# Altium project Face_PWR1V0.PrjPcb
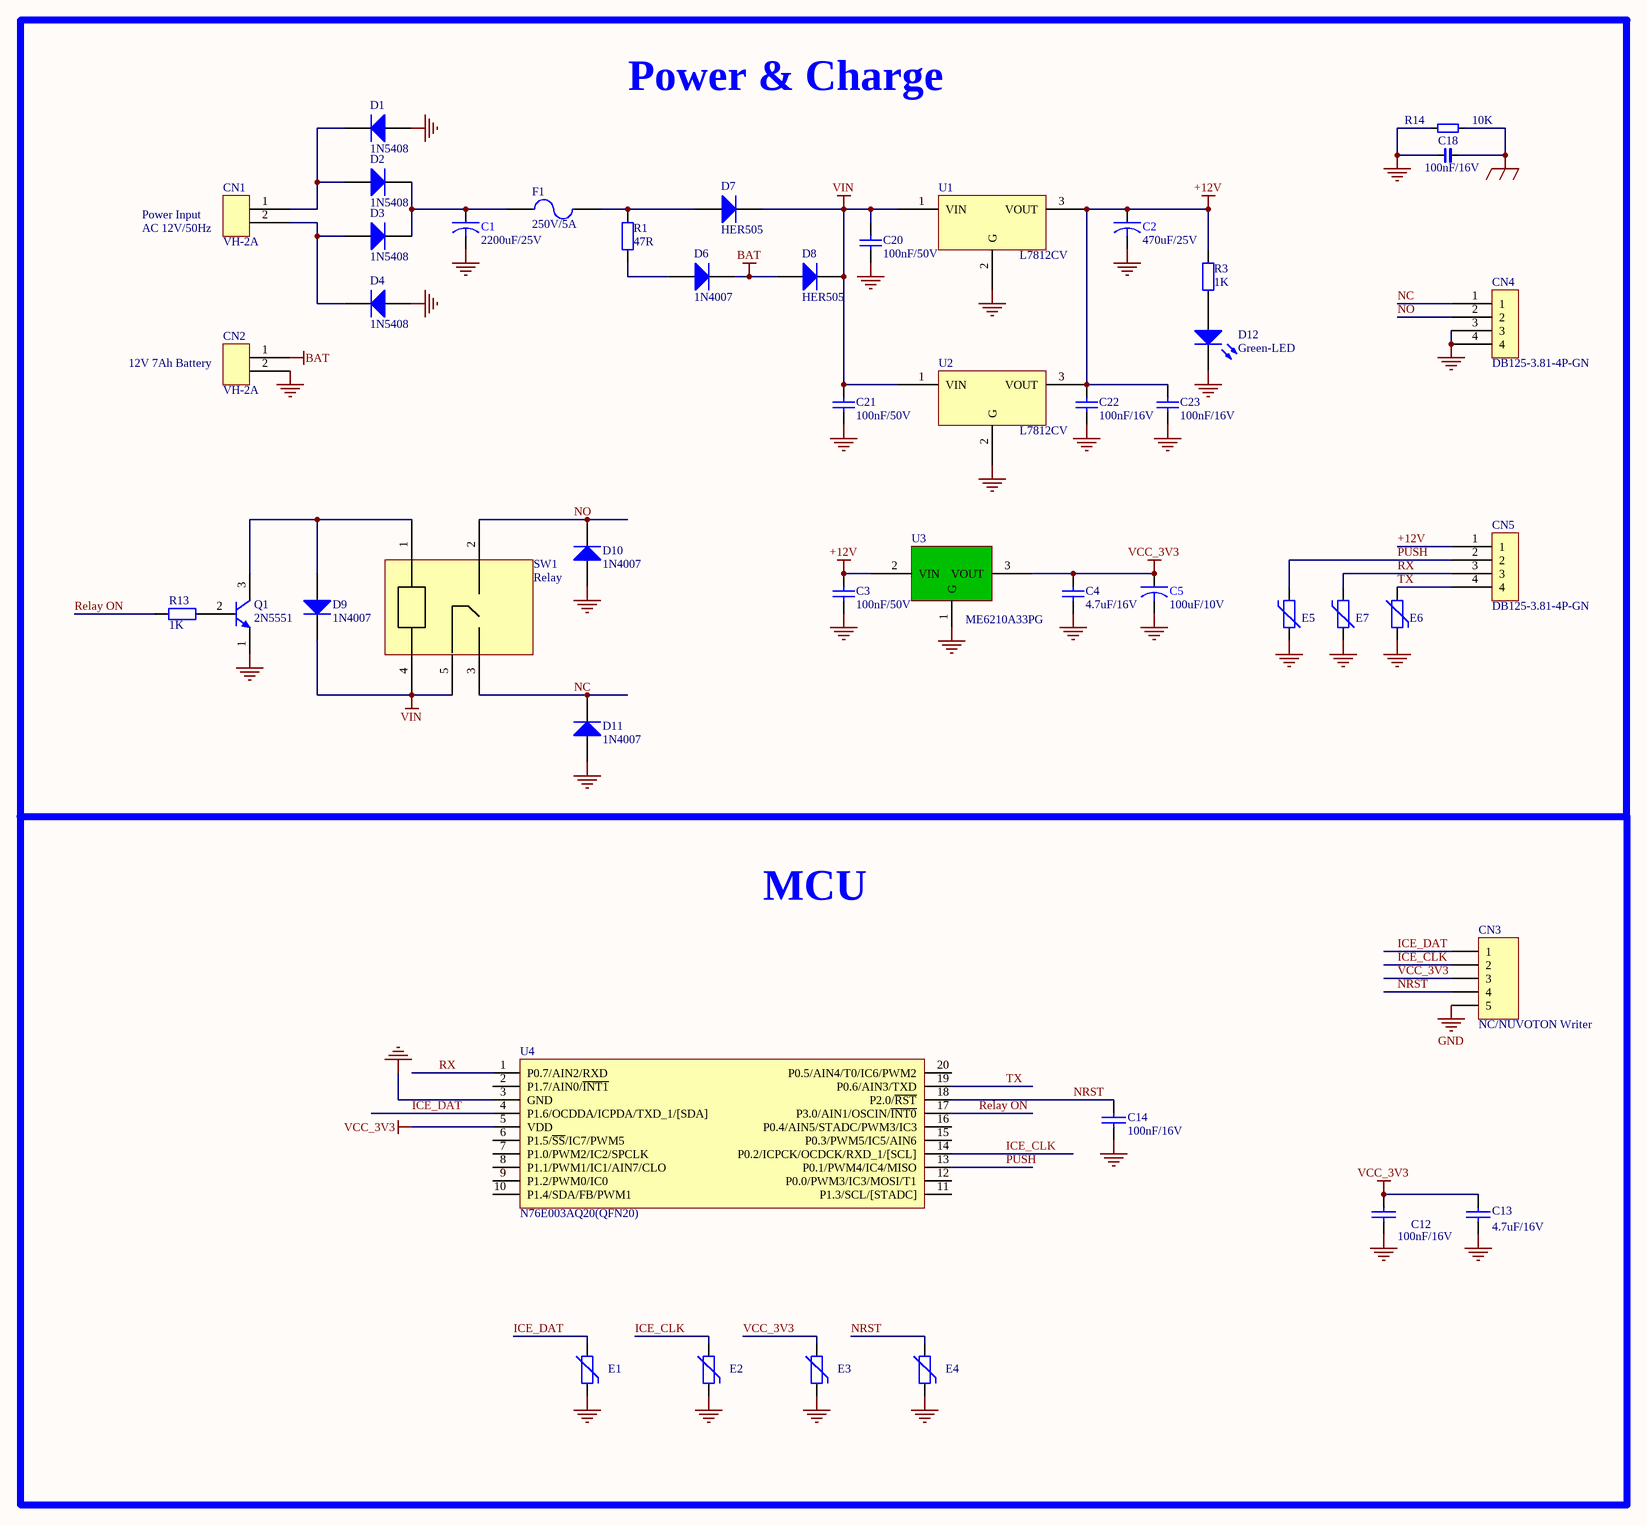
[diagram p0: Face_PWR1V0.SchDoc]
1 sheet, 47 parts. Net scope: global (net labels, ports and power ports of the same name join across sheets).
Board file: Face_PWR1V0.PcbDoc

## Sheet Face_PWR1V0.SchDoc
size C

### Parts
C1  2200uF/25V  [CAP 13x21mm]
C2  470uF/25V  [CAP-TH_BD8.0-P3.50-D1.0-FD]
C3  100nF/50V  [C0603]
C4  4.7uF/16V  [C0603]
C5  100uF/10V  [C_ALU_5.3MM]
C12  100nF/16V  [C0402]
C13  4.7uF/16V  [C0603]
C14  100nF/16V  [C0402]
C18  100nF/16V  [C0402]
C20  100nF/50V  [C0603]
C21  100nF/50V  [C0603]
C22  100nF/16V  [C0402]
C23  100nF/16V  [C0402]
CN1  VH-2A  [VH3.96-2A]
CN2  VH-2A  [VH3.96-2A]
CN3  NC/NUVOTON Writer  [HD5_2.0]
CN4  DB125-3.81-4P-GN  [DB125-3.81-4P-GN]
CN5  DB125-3.81-4P-GN  [DB125-3.81-4P-GN]
D1  1N5408  [DO-201AD]
D2  1N5408  [DO-201AD]
D3  1N5408  [DO-201AD]
D4  1N5408  [DO-201AD]
D6  1N4007  [DO-41]
D7  HER505  [DO-201AD]
D8  HER505  [DO-201AD]
D9  1N4007  [DO-41]
D10  1N4007  [DO-41]
D11  1N4007  [DO-41]
D12  Green-LED  [LED-TH_BD3.0-P2.54-FD]
E1  SFI0402-050E330NP-LF  [R0402]  (value not drawn)
E2  SFI0402-050E330NP-LF  [R0402]  (value not drawn)
E3  SFI0402-050E330NP-LF  [R0402]  (value not drawn)
E4  SFI0402-050E330NP-LF  [R0402]  (value not drawn)
E5  SFI0402-050E330NP-LF  [R0402]  (value not drawn)
E6  SFI0402-050E330NP-LF  [R0402]  (value not drawn)
E7  SFI0402-050E330NP-LF  [R0402]  (value not drawn)
F1  250V/5A  [5x20 Fuse socket]
Q1  2N5551  [TO-92-3_L4.8-W3.7-P2.54L]
R1  47R  [AXIAL-1.3]
R3  1K  [R0603]
R13  1K  [R0402]
R14  10K  [R0402]
SW1  Relay  [RELAY-TH_SRD-XXVDC-XL-C]
U1  L7812CV  [TO-220-3]
U2  L7812CV  [TO-220-3]
U3  ME6210A33PG  [SOT-89]
U4  N76E003AQ20(QFN20)  [QFN20_3*3mm]

### Blocks framed on the sheet
Power & Charge: C1-C5 C18 C20-C23 CN1 CN2 CN4 CN5 D1-D4 D6-D12 E5-E7 F1 Q1 R1 R3 R13 R14 SW1 U1-U3

### Nets
+12V: C2.1 C3.2 C22.2 C23.2 CN5.1 R3.2 U1.3(VOUT) U2.3(VOUT) U3.2(VIN)
BAT: CN2.1 D6.2(K) D8.1(A)
BODY GND: C18.2 R14.2
GND: C1.2 C2.2 C3.1 C4.1 C5.2 C12.2 C13.2 C14.2 C18.1 C20.1 C21.1 C22.1 C23.1 CN2.2 CN3.5 CN4.3 CN4.4 D1.1(A) D4.1(A) D10.1(A) D11.1(A) D12.2(K) E1.2 E2.2 E3.2 E4.2 E5.1 E6.2 E7.1 Q1.1(E) R14.1 U1.2(G) U2.2(G) U3.1(G) U4.3(GND)
VCC_3V3: C4.2 C5.1 C12.1 C13.1 CN3.3 E3.1 U3.3(VOUT) U4.5(VDD)
VIN: C20.2 C21.2 D7.2(K) D8.2(K) D9.2(K) SW1.4 SW1.5 U1.1(VIN) U2.1(VIN)
ICE_CLK: CN3.2 E2.1 U4.14(P0.2/ICPCK/OCDCK/RXD_1/[SCL])
ICE_DAT: CN3.1 E1.1 U4.4(P1.6/OCDDA/ICPDA/TXD_1/[SDA])
NC: CN4.1 D11.2(K) SW1.3
NO: CN4.2 D10.2(K) SW1.2
NRST: C14.1 CN3.4 E4.1 U4.18(P2.0/~{RST})
PUSH: CN5.2 E5.2 U4.13(P0.1/PWM4/IC4/MISO)
Relay ON: R13.2 U4.17(P3.0/AIN1/OSCIN/~{INT0})
RX: CN5.3 E7.2 U4.1(P0.7/AIN2/RXD)
TX: CN5.4 E6.1 U4.19(P0.6/AIN3/TXD)
NetC1_1: C1.1 D2.2(K) D3.2(K) F1.1
NetCN1_1: CN1.1 D1.2(K) D2.1(A)
NetCN1_2: CN1.2 D3.1(A) D4.2(K)
NetD6_1: D6.1(A) R1.1
NetD7_1: D7.1(A) F1.2 R1.2
NetD9_1: D9.1(A) Q1.3(C) SW1.1
NetD12_1: D12.1(A) R3.1
NetQ1_2: Q1.2(B) R13.1

Not connected (* = marked no-connect by the designer): U4 2(P1.7/AIN0/~{INT1}) 6(P1.5/~{SS}/IC7/PWM5) 7(P1.0/PWM2/IC2/SPCLK) 8(P1.1/PWM1/IC1/AIN7/CLO) 9(P1.2/PWM0/IC0) 10(P1.4/SDA/FB/PWM1) 11(P1.3/SCL/[STADC]) 12(P0.0/PWM3/IC3/MOSI/T1) 15(P0.3/PWM5/IC5/AIN6) 16(P0.4/AIN5/STADC/PWM3/IC3) 20(P0.5/AIN4/T0/IC6/PWM2)

### Notes on the sheet
- (near CN1) Power Input
- (near CN1) AC 12V/50Hz
- (near CN2) 12V 7Ah Battery
- MCU
- Title
- Size:
- A1
- Number:
- Revision:
- Date:
- File:
- Time:
- Sheet
- of

### Library data of the parts
C1 = CAP_Polaric: 2200uF 25V 13*20
C2 = CAP_Polaric: 470uF/25V(RC025M471LO8*14TH-2A1E)
C3 C20 C21 = Cap: 0.1uF/50V 10%  0603 X5R ROHS; Published: 8-Jun-2000; LatestRevisionDate: 17-Jul-2002; LatestRevisionNote: Re-released for DXP Platform.; PackageReference: RAD-0.3; Publisher: Altium Limited; PackageDescription: Radial Cap, Thru-Hole; 2 Leads; 0.3 in Pin Spacing
C4 = Cap: 4.7uF/16V 10% 0603 X7R ROHS; Published: 8-Jun-2000; LatestRevisionDate: 17-Jul-2002; LatestRevisionNote: Re-released for DXP Platform.; PackageReference: RAD-0.3; Publisher: Altium Limited; PackageDescription: Radial Cap, Thru-Hole; 2 Leads; 0.3 in Pin Spacing
C5 = CAP_Polaric: CS1A101M-CRD54, 100uF/10V
C12 C14 = CAP: 100nF/16V 10% 0402 X7R ROHS
C13 = CAP: 4.7uF/16V 10% 0603 X7R ROHS
C18 = CAP_0603A: 100nF/16V 10% 0402 X7R ROHS
C22 C23 = Cap: 100nF ±10% 16V X7R 0402 ROHS; Published: 8-Jun-2000; LatestRevisionDate: 17-Jul-2002; LatestRevisionNote: Re-released for DXP Platform.; PackageReference: RAD-0.3; Publisher: Altium Limited; PackageDescription: Radial Cap, Thru-Hole; 2 Leads; 0.3 in Pin Spacing
CN1 CN2 CN4 CN5 U1 U2 = Component_1
CN3 = Header 5: SH1.25_5P_SMD_TOP
D1-D4 = M2 (DO-214AC): 1N5408(DO-201AD)
D6 D9-D11 = M2 (DO-214AC): 1N4007(DO-41)
D7 D8 = M2 (DO-214AC): HER505(DO-201AD)
D12 = LED1: TJ-L3FYTGCWMCGLFLC6B-A5; Published: 8-Jun-2000; LatestRevisionDate: 08-Jul-2005; LatestRevisionNote: Mech Layer 1 removed.; PackageReference: LED-1; Publisher: Altium Limited; PackageDescription: LED; 2 Leads
E1-E7 = VARISTOR
F1 = Fuse 2: 250V/5A(5F.5000220000R1); Published: 8-Jun-2000; LatestRevisionDate: 17-Jul-2002; LatestRevisionNote: Re-released for DXP Platform.; PackageReference: PIN-W2/E2.8; Publisher: Altium Limited; PackageDescription: Thru-Hole; 2 Leads
Q1 = 2N3904: Published: 8-Jun-2000; LatestRevisionDate: 15-Jan-2003; LatestRevisionNote: PCB Footprint 'BCY-W3/D4.7' replaced; DatasheetVersion: 1997; PackageVersion: Sep-1998; PackageReference: TO-92A; Publisher: Altium Limited; PackageDescription: TO, Flat Index; 3 In-Line, Axial Leads; Body Dia. 4.5mm; Leads 0.51 x 0.48 mm (max); ComponentLink1Description: Manufacturer Link; ComponentLink1URL: http://www.fairchildsemi.com/; ComponentLink2Description: Datasheet; ComponentLink2URL: http://www.fairchildsemi.com/ds/2N%2F2N3904.pdf
R1 = Res2: 47R/6W 5%(EWWR0006J47R0T9); Published: 8-Jun-2000; LatestRevisionDate: 17-Jul-2002; LatestRevisionNote: Re-released for DXP Platform.; PackageReference: AXIAL-0.4; Publisher: Altium Limited; PackageDescription: Axial Device, Thru-Hole; 2 Leads; 0.4 in Pin Spacing
R3 = Res2: 1K +/-5% 1/10W 0603 ROHS; Published: 8-Jun-2000; LatestRevisionDate: 17-Jul-2002; LatestRevisionNote: Re-released for DXP Platform.; PackageReference: AXIAL-0.4; Publisher: Altium Limited; PackageDescription: Axial Device, Thru-Hole; 2 Leads; 0.4 in Pin Spacing
R13 = Res2: 1K +/-5% 1/16W 0402 ROHS; Published: 8-Jun-2000; LatestRevisionDate: 17-Jul-2002; LatestRevisionNote: Re-released for DXP Platform.; PackageReference: AXIAL-0.4; Publisher: Altium Limited; PackageDescription: Axial Device, Thru-Hole; 2 Leads; 0.4 in Pin Spacing
R14 = Res Semi: 10K +/-5% 1/16W 0402 ROHS; Value: 1K; Published: 8-Jun-2000; Revision: July-2002: Re-released for DXP Platform.; Publisher: Altium Limited
SW1 = Component_1: SRD-12VDC-SL-C
U3 = HT7333: ME6210A33PG (SOT89-3)
U4 = N76E003AQ20: 物料编号: EIC00048; 名称: IC; 规格，型号: STM8S003F3 (TSSOP20)